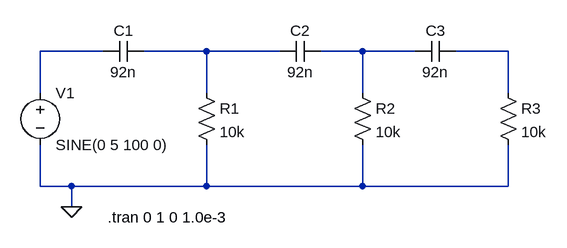
[diagram p0: schematic Draft13.asc]
Draft13.asc, the LTspice schematic file:
Version 4
SHEET 1 880 680
WIRE 16 128 -80 128
WIRE 176 128 80 128
WIRE 288 128 176 128
WIRE 416 128 352 128
WIRE 496 128 416 128
WIRE 640 128 560 128
WIRE -80 192 -80 128
WIRE 176 192 176 128
WIRE 416 192 416 128
WIRE 640 192 640 128
WIRE -80 336 -80 272
WIRE -32 336 -80 336
WIRE 176 336 176 272
WIRE 176 336 -32 336
WIRE 416 336 416 272
WIRE 416 336 176 336
WIRE 640 336 640 272
WIRE 640 336 416 336
WIRE -32 368 -32 336
FLAG -32 368 0
SYMBOL cap 80 112 R90
WINDOW 0 0 32 VBottom 2
WINDOW 3 32 32 VTop 2
SYMATTR InstName C1
SYMATTR Value 92n
SYMBOL res 160 176 R0
SYMATTR InstName R1
SYMATTR Value 10k
SYMBOL voltage -80 176 R0
SYMATTR InstName V1
SYMATTR Value SINE(0 5 100 0)
SYMBOL cap 352 112 R90
WINDOW 0 0 32 VBottom 2
WINDOW 3 32 32 VTop 2
SYMATTR InstName C2
SYMATTR Value 92n
SYMBOL cap 560 112 R90
WINDOW 0 0 32 VBottom 2
WINDOW 3 32 32 VTop 2
SYMATTR InstName C3
SYMATTR Value 92n
SYMBOL res 400 176 R0
SYMATTR InstName R2
SYMATTR Value 10k
SYMBOL res 624 176 R0
SYMATTR InstName R3
SYMATTR Value 10k
TEXT 24 384 Left 2 !.tran 0 1 0 1.0e-3

The netlist it stands for:
* Draft13.asc
C1 N002 N001 92n
R1 N002 0 10k
V1 N001 0 SINE(0 5 100 0)
C2 N003 N002 92n
C3 N004 N003 92n
R2 N003 0 10k
R3 N004 0 10k
.tran 0 1 0 1.0e-3
.backanno
.end